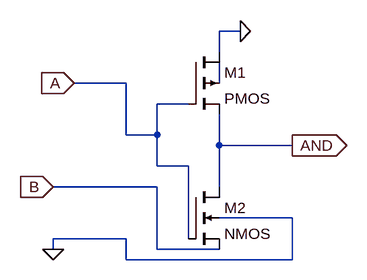
[diagram p0: schematic AND_GDI.asc]
AND_GDI.asc, the LTspice schematic file:
Version 4
SHEET 1 880 680
WIRE 240 16 208 16
WIRE 208 48 208 16
WIRE 64 96 -16 96
WIRE 208 96 208 64
WIRE 160 128 112 128
WIRE 64 176 64 96
WIRE 112 176 112 128
WIRE 112 176 64 176
WIRE 208 192 208 144
WIRE 320 192 208 192
WIRE 112 224 112 176
WIRE 160 224 112 224
WIRE 112 256 -48 256
WIRE 208 256 208 192
WIRE 320 304 208 304
WIRE 64 336 -48 336
WIRE 160 336 160 224
WIRE -48 352 -48 336
WIRE 112 352 112 256
WIRE 208 352 112 352
WIRE 64 368 64 336
WIRE 320 368 320 304
WIRE 320 368 64 368
FLAG 240 16 0
FLAG -16 96 A
IOPIN -16 96 In
FLAG -48 256 B
IOPIN -48 256 In
FLAG 320 192 AND
IOPIN 320 192 Out
FLAG -48 352 0
SYMBOL pmos4 160 48 R0
SYMATTR InstName M1
SYMBOL nmos4 160 256 R0
SYMATTR InstName M2

The netlist it stands for:
* AND_GDI.asc
M1 0 A AND N001 PMOS
M2 AND A B 0 NMOS
.model NMOS NMOS
.model PMOS PMOS
.lib standard.mos
.backanno
.end